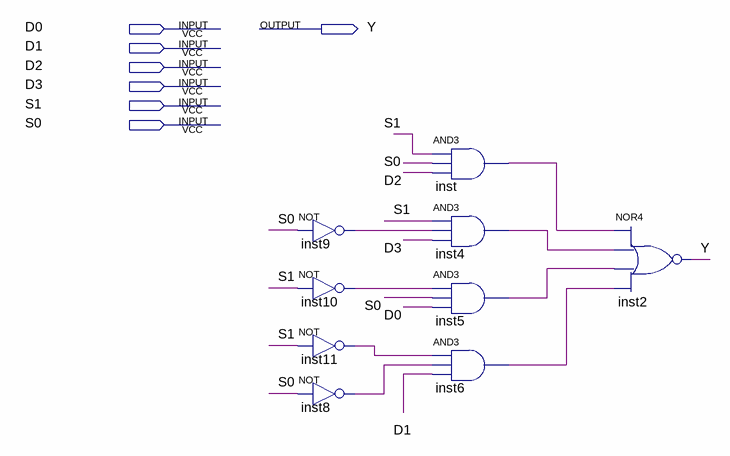
[diagram p0: schematic sheet]
// Quartus schematic lab3ex.bdf as structural Verilog: 9 symbols, 7 pins
module lab3ex (
  input  D0,
  input  D1,
  input  D2,
  input  D3,
  input  S1,
  input  S0,
  output Y
);

  wire inst4_out, inst5_out, inst6_out, inst8_out, inst9_out, inst10_out, inst11_out, inst_out;

  not inst9 (inst9_out, S0);
  not inst10 (inst10_out, S1);
  not inst11 (inst11_out, S1);
  not inst8 (inst8_out, S0);
  and inst (inst_out, S1, S0, D2);
  and inst4 (inst4_out, S1, inst9_out, D3);
  and inst5 (inst5_out, inst10_out, S0, D0);
  and inst6 (inst6_out, inst11_out, inst8_out, D1);
  nor inst2 (Y, inst_out, inst4_out, inst5_out, inst6_out);
endmodule
